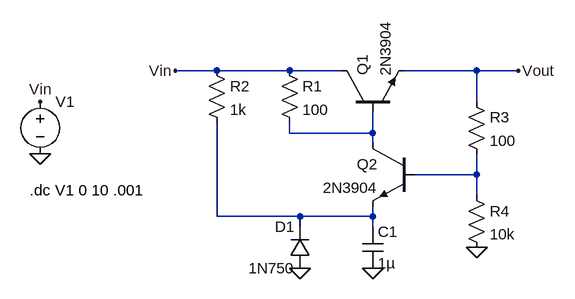
[diagram p0: schematic 09A-15.asc]
09A-15.asc, the LTspice schematic file:
Version 4.1
SHEET 1 880 680
WIRE -64 96 -128 96
WIRE 48 96 -64 96
WIRE 128 96 48 96
WIRE 336 96 224 96
WIRE 400 96 336 96
WIRE 336 144 336 96
WIRE 48 192 48 176
WIRE 176 192 176 160
WIRE 176 192 48 192
WIRE 176 208 176 192
WIRE 336 256 336 224
WIRE 336 256 240 256
WIRE 336 288 336 256
WIRE -64 320 -64 176
WIRE 64 320 -64 320
WIRE 176 320 176 304
WIRE 176 320 64 320
WIRE 64 336 64 320
WIRE 176 336 176 320
FLAG 64 400 0
FLAG 176 400 0
FLAG 336 368 0
FLAG -128 96 Vin
FLAG 400 96 Vout
FLAG -336 224 0
FLAG -336 144 Vin
SYMBOL npn 128 160 R270
SYMATTR InstName Q1
SYMATTR Value 2N3904
SYMBOL npn 240 208 M0
SYMATTR InstName Q2
SYMATTR Value 2N3904
SYMBOL res 32 80 R0
SYMATTR InstName R1
SYMATTR Value 100
SYMBOL res -80 80 R0
SYMATTR InstName R2
SYMATTR Value 1k
SYMBOL res 320 128 R0
SYMATTR InstName R3
SYMATTR Value 100
SYMBOL res 320 272 R0
SYMATTR InstName R4
SYMATTR Value 10k
SYMBOL cap 160 336 R0
SYMATTR InstName C1
SYMATTR Value 1µ
SYMBOL diode 80 400 R180
WINDOW 0 24 64 Left 2
WINDOW 3 24 0 Left 2
SYMATTR InstName D1
SYMATTR Value 1N750
SYMATTR Description Diode
SYMATTR Type diode
SYMBOL voltage -336 128 R0
WINDOW 123 0 0 Left 0
WINDOW 39 0 0 Left 0
SYMATTR InstName V1
SYMATTR Value ""
TEXT -352 280 Left 2 !.dc V1 0 10 .001

The netlist it stands for:
* 09A-15.asc
Q1 Vin N001 Vout 0 2N3904
Q2 N001 N002 N003 0 2N3904
R1 Vin N001 100
R2 Vin N003 1k
R3 Vout N002 100
R4 N002 0 10k
C1 N003 0 1µ
D1 0 N003 1N750
V1 Vin 0
.model D D
.lib standard.dio
.model NPN NPN
.model PNP PNP
.lib standard.bjt
.dc V1 0 10 .001
.backanno
.end